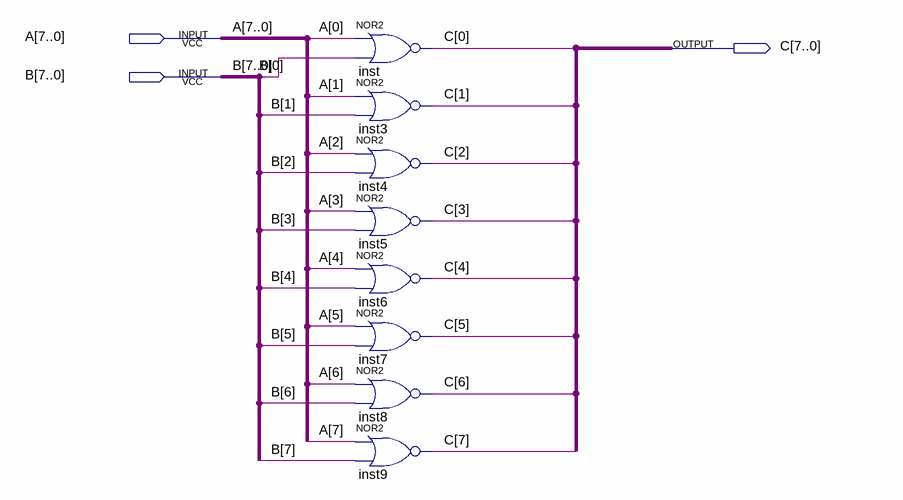
[diagram p0: schematic sheet]
// Quartus schematic NOR.bdf as structural Verilog: 8 symbols, 3 pins
module NOR (
  input  [7:0] A,
  input  [7:0] B,
  output [7:0] C
);

  nor inst (C[0], A[0], B[0]);
  nor inst3 (C[1], A[1], B[1]);
  nor inst4 (C[2], A[2], B[2]);
  nor inst5 (C[3], A[3], B[3]);
  nor inst6 (C[4], A[4], B[4]);
  nor inst7 (C[5], A[5], B[5]);
  nor inst8 (C[6], A[6], B[6]);
  nor inst9 (C[7], A[7], B[7]);
endmodule
